# Altium schematic sheet Top_Level.SchDoc: FMC interface to FPGA - Top Level
size A4; Date: 27.09.2023; ApprovedBy: M.Sc. Tobias Wirth; CheckedBy: M.Sc. Tobias Wirth; Author: M.Sc. Tobias Wirth; CompanyName: University of Stuttgart; DrawnBy: M.Sc. Tobias Wirth; Engineer: M.Sc. Tobias Wirth; Organization: IIS; Address1: Pfaffenwaldring 47; Address2: 70569 Stuttgart; Revision: V1.1; SheetNumber: 1; SheetTotal: 11; ProjectNameAlt: AUS - NMR System; Time: 10:00; ImagePath: N/A; Application_BuildNumber: N/A
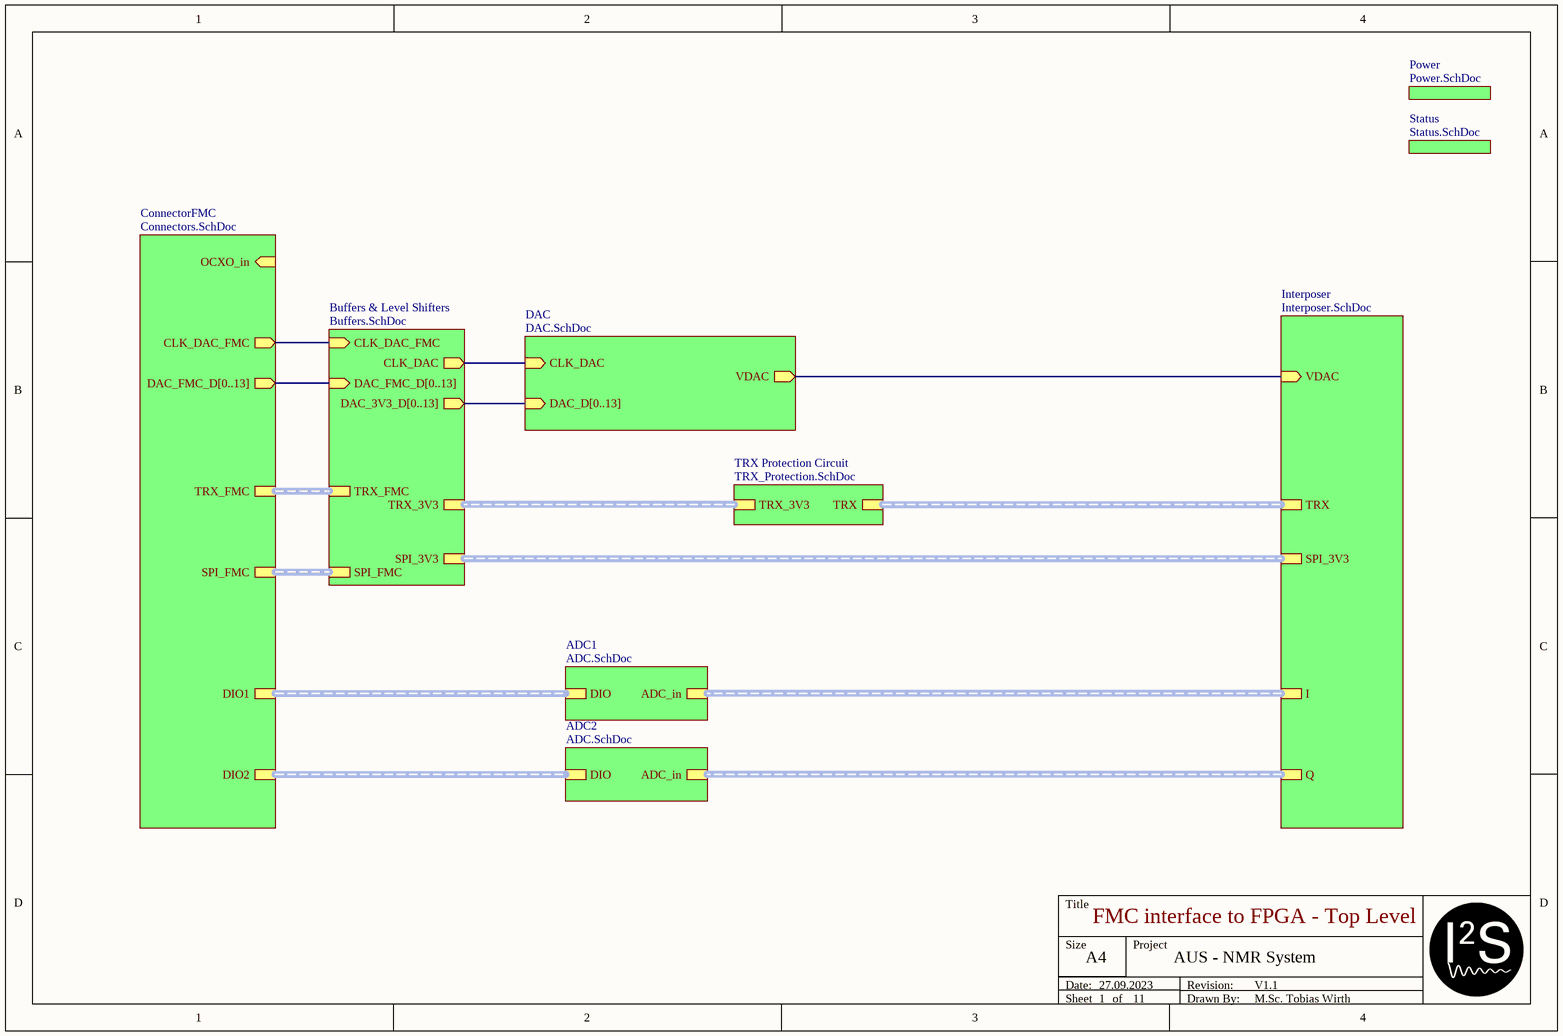
[diagram p0: Top_Level.SchDoc]

## Sub-sheets
ADC1 = ADC.SchDoc: DIO (harness DIO), ADC_in (harness ADC_IN)
ADC2 = ADC.SchDoc: DIO (harness DIO), ADC_in (harness ADC_IN)
Buffers & Level Shifters = Buffers.SchDoc: DAC_FMC_D[0..13] (in), CLK_DAC_FMC (in), TRX_FMC (harness TRX_FMC), SPI_FMC (harness SPI_FMC), CLK_DAC (out), DAC_3V3_D[0..13] (out), TRX_3V3 (harness TRX_3V3), SPI_3V3 (harness SPI_3V3)
ConnectorFMC = Connectors.SchDoc: DIO1 (harness DIO), DIO2 (harness DIO), DAC_FMC_D[0..13] (out), CLK_DAC_FMC (out), OCXO_in (in), TRX_FMC (harness TRX_FMC), SPI_FMC (harness SPI_FMC)
DAC = DAC.SchDoc: VDAC (out), CLK_DAC (in), DAC_D[0..13] (in)
Interposer = Interposer.SchDoc: VDAC (in), TRX (harness TRX), SPI_3V3 (harness SPI_3V3), Q (harness ADC_IN), I (harness ADC_IN)
Power = Power.SchDoc: no entries
Status = Status.SchDoc: no entries
TRX Protection Circuit = TRX_Protection.SchDoc: TRX_3V3 (harness TRX_3V3), TRX (harness TRX)

## Nets
(unnamed): sheet ConnectorFMC/CLK_DAC_FMC, sheet Buffers & Level Shifters/CLK_DAC_FMC
(unnamed): sheet DAC/VDAC, sheet Interposer/VDAC
(unnamed): sheet DAC/CLK_DAC, sheet Buffers & Level Shifters/CLK_DAC

## Buses and harness runs
bus sheet Buffers & Level Shifters/DAC_3V3_D[0..13] = sheet DAC/DAC_D[0..13]
bus sheet Buffers & Level Shifters/DAC_FMC_D[0..13] = sheet ConnectorFMC/DAC_FMC_D[0..13]
harness sheet ADC1/ADC_in = sheet Interposer/I
harness sheet ADC1/DIO = sheet ConnectorFMC/DIO1
harness sheet ADC2/ADC_in = sheet Interposer/Q
harness sheet ADC2/DIO = sheet ConnectorFMC/DIO2
harness sheet Buffers & Level Shifters/SPI_3V3 = sheet Interposer/SPI_3V3
harness sheet Buffers & Level Shifters/SPI_FMC = sheet ConnectorFMC/SPI_FMC
harness sheet Buffers & Level Shifters/TRX_3V3 = sheet TRX Protection Circuit/TRX_3V3
harness sheet Buffers & Level Shifters/TRX_FMC = sheet ConnectorFMC/TRX_FMC
harness sheet Interposer/TRX = sheet TRX Protection Circuit/TRX

## Notes on the sheet
- Title
- Size
- Date:
- Sheet
- A4
- of
- Project
- Drawn By:
- Revision: